# EasyEDA schematic SCH_drone-smt-3-high-power_2022-06-06.json
TITLE: BLDC BEMF Power Circuit; REV: 2.4; Date: 2021-08-25; Sheet: 1/1; Company: N/A
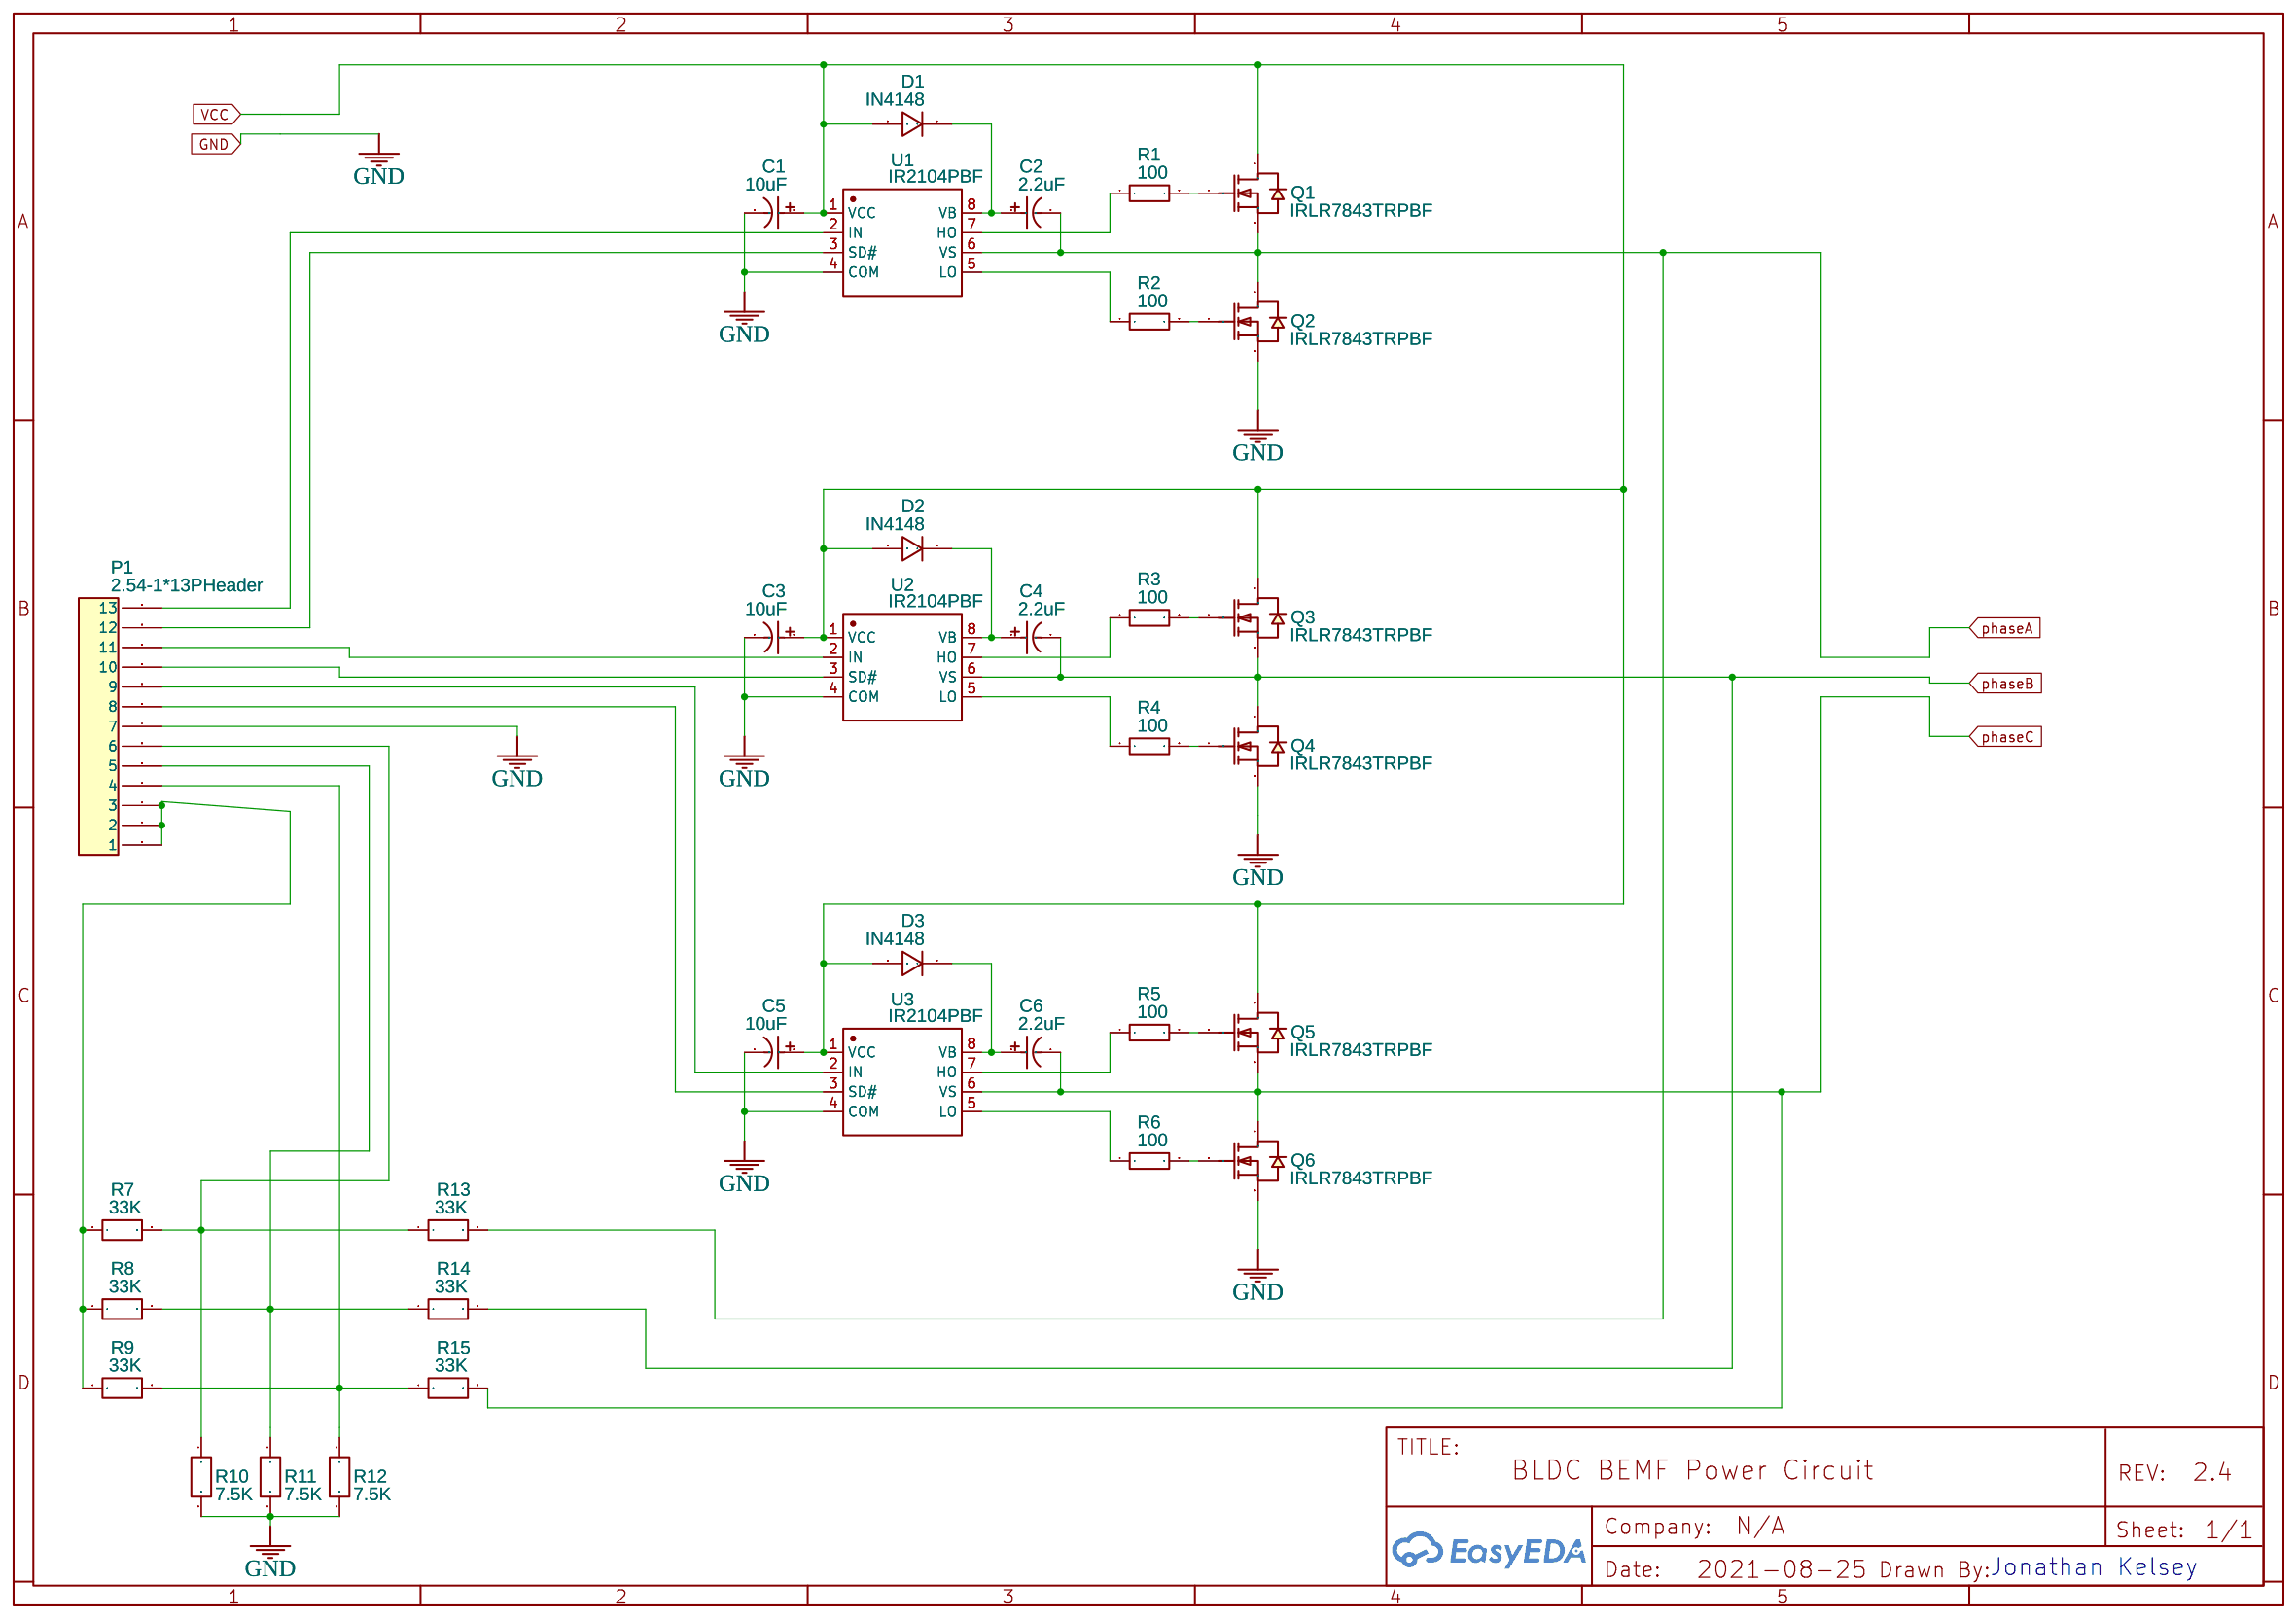
[diagram p0: schematic sheet]

## Parts
C1  10uF  [CAP-TH_BD5.0-P2.00-D0.8-FD]
C2  2.2uF  [CAP-TH_BD4.0-P1.50-D0.8-FD]
C3  10uF  [CAP-TH_BD5.0-P2.00-D0.8-FD]
C4  2.2uF  [CAP-TH_BD4.0-P1.50-D0.8-FD]
C5  10uF  [CAP-TH_BD5.0-P2.00-D0.8-FD]
C6  2.2uF  [CAP-TH_BD4.0-P1.50-D0.8-FD]
D1  IN4148  [DO-35_BD2.0-L4.2-P8.20-D0.5-RD]
D2  IN4148  [DO-35_BD2.0-L4.2-P8.20-D0.5-RD]
D3  IN4148  [DO-35_BD2.0-L4.2-P8.20-D0.5-RD]
P1  2.54-1*13PHeader  [HDR-TH_13P-P2.54-H-M-W10.0]
Q1  IRLR7843TRPBF  [TO-252-2_L6.5-W6.1-P4.58-LS10.0-TR]
Q2  IRLR7843TRPBF  [TO-252-2_L6.5-W6.1-P4.58-LS10.0-TR]
Q3  IRLR7843TRPBF  [TO-252-2_L6.5-W6.1-P4.58-LS10.0-TR]
Q4  IRLR7843TRPBF  [TO-252-2_L6.5-W6.1-P4.58-LS10.0-TR]
Q5  IRLR7843TRPBF  [TO-252-2_L6.5-W6.1-P4.58-LS10.0-TR]
Q6  IRLR7843TRPBF  [TO-252-2_L6.5-W6.1-P4.58-LS10.0-TR]
R1  100  [RES-TH_BD3.2-L9.0-P13.00-D0.5]
R2  100  [RES-TH_BD3.2-L9.0-P13.00-D0.5]
R3  100  [RES-TH_BD3.2-L9.0-P13.00-D0.5]
R4  100  [RES-TH_BD3.2-L9.0-P13.00-D0.5]
R5  100  [RES-TH_BD3.2-L9.0-P13.00-D0.5]
R6  100  [RES-TH_BD3.2-L9.0-P13.00-D0.5]
R7  33K  [RES-TH_BD3.3-L9.2-P13.20-D0.6]
R8  33K  [RES-TH_BD3.3-L9.2-P13.20-D0.6]
R9  33K  [RES-TH_BD3.3-L9.2-P13.20-D0.6]
R10  7.5K  [RES-TH_BD3.3-L9.2-P13.20-D0.6]
R11  7.5K  [RES-TH_BD3.3-L9.2-P13.20-D0.6]
R12  7.5K  [RES-TH_BD3.3-L9.2-P13.20-D0.6]
R13  33K  [RES-TH_BD3.3-L9.2-P13.20-D0.6]
R14  33K  [RES-TH_BD3.3-L9.2-P13.20-D0.6]
R15  33K  [RES-TH_BD3.3-L9.2-P13.20-D0.6]
U1  IR2104PBF  [DIP-8_L9.9-W6.6-P2.54-LS7.62-BL]
U2  IR2104PBF  [DIP-8_L9.9-W6.6-P2.54-LS7.62-BL]
U3  IR2104PBF  [DIP-8_L9.9-W6.6-P2.54-LS7.62-BL]

## Library data of the parts
C1 C3 C5 = 10uF 50V 5*11: Supplier: LCSC; Manufacturer: ValuePro; Supplier Part: C43345; JLCPCB Part Class: Extended Part
C2 C4 C6 = 2.2uf/50V: Supplier: LCSC; Manufacturer: ValuePro; Supplier Part: C2065; JLCPCB Part Class: Extended Part
D1-D3 = IN4148: Supplier: LCSC; Supplier Part: C14538; Manufacturer: Semtech; Contributor: LCSC; JLCPCB Part Class: Extended Part
P1 = 2.54-1*13PHeader: Supplier: LCSC; Manufacturer: BOOMELE; Supplier Part: C52928; JLCPCB Part Class: Extended Part
Q1-Q6 = IRLR7843TRPBF: Supplier: LCSC; Manufacturer: IR; Supplier Part: C21988; JLCPCB Part Class: Extended Part
R1-R6 = MF1/2W-100Ω±1% T52: Supplier: LCSC; Supplier Part: C119407; Manufacturer: Chian Chia Elec; Contributor: LCSC; JLCPCB Part Class: Extended Part
R7-R9 R13-R15 = RN 1WS 33K F T/B A1: Supplier: LCSC; Supplier Part: C433632; Manufacturer: TyoHM; Contributor: LCSC; JLCPCB Part Class: Extended Part
R10-R12 = RN1/2W7.5KΩFT/BA1: Supplier: LCSC; Supplier Part: C385665; Manufacturer: TyoHM; Contributor: LCSC; JLCPCB Part Class: Extended Part
U1-U3 = IR2104PBF: Supplier: LCSC; Manufacturer: IR; Supplier Part: C2959; JLCPCB Part Class: Extended Part

## Nets
GND: C1.2 C3.2 C5.2 P1.7 Q2.3(S) Q4.3(S) Q6.3(S) R10.2 R11.2 R12.2 U1.4(COM) U2.4(COM) U3.4(COM)
VCC: C1.1 C3.1 C5.1 D1.2 D2.2 D3.2 Q1.4(D) Q3.4(D) Q5.4(D) U1.1(VCC) U2.1(VCC) U3.1(VCC)
phaseA: C2.2 Q1.3(S) Q2.4(D) R13.2 U1.6(VS)
phaseB: C4.2 Q3.3(S) Q4.4(D) R14.2 U2.6(VS)
phaseC: C6.2 Q5.3(S) Q6.4(D) R15.2 U3.6(VS)
Net-(C2-1): C2.1 D1.1 U1.8(VB)
Net-(C4-1): C4.1 D2.1 U2.8(VB)
Net-(C6-1): C6.1 D3.1 U3.8(VB)
Net-(P1-1): P1.1 P1.2 P1.3 R7.1 R8.1 R9.1
Net-(P1-4): P1.4 R9.2 R12.1 R15.1
Net-(P1-5): P1.5 R8.2 R11.1 R14.1
Net-(P1-6): P1.6 R7.2 R10.1 R13.1
Net-(P1-8): P1.8 U3.3(SD#)
Net-(P1-9): P1.9 U3.2(IN)
Net-(P1-10): P1.10 U2.3(SD#)
Net-(P1-11): P1.11 U2.2(IN)
Net-(P1-12): P1.12 U1.3(SD#)
Net-(P1-13): P1.13 U1.2(IN)
Net-(Q1-1): Q1.1(G) R1.2
Net-(Q2-1): Q2.1(G) R2.2
Net-(Q3-1): Q3.1(G) R3.2
Net-(Q4-1): Q4.1(G) R4.2
Net-(Q5-1): Q5.1(G) R5.2
Net-(Q6-1): Q6.1(G) R6.2
Net-(R1-1): R1.1 U1.7(HO)
Net-(R2-1): R2.1 U1.5(LO)
Net-(R3-1): R3.1 U2.7(HO)
Net-(R4-1): R4.1 U2.5(LO)
Net-(R5-1): R5.1 U3.7(HO)
Net-(R6-1): R6.1 U3.5(LO)

## Notes on the sheet
- Jonathan Kelsey
